# Altium schematic sheet 02_NRF52832.SchDoc: WMI (BLE)
size A4
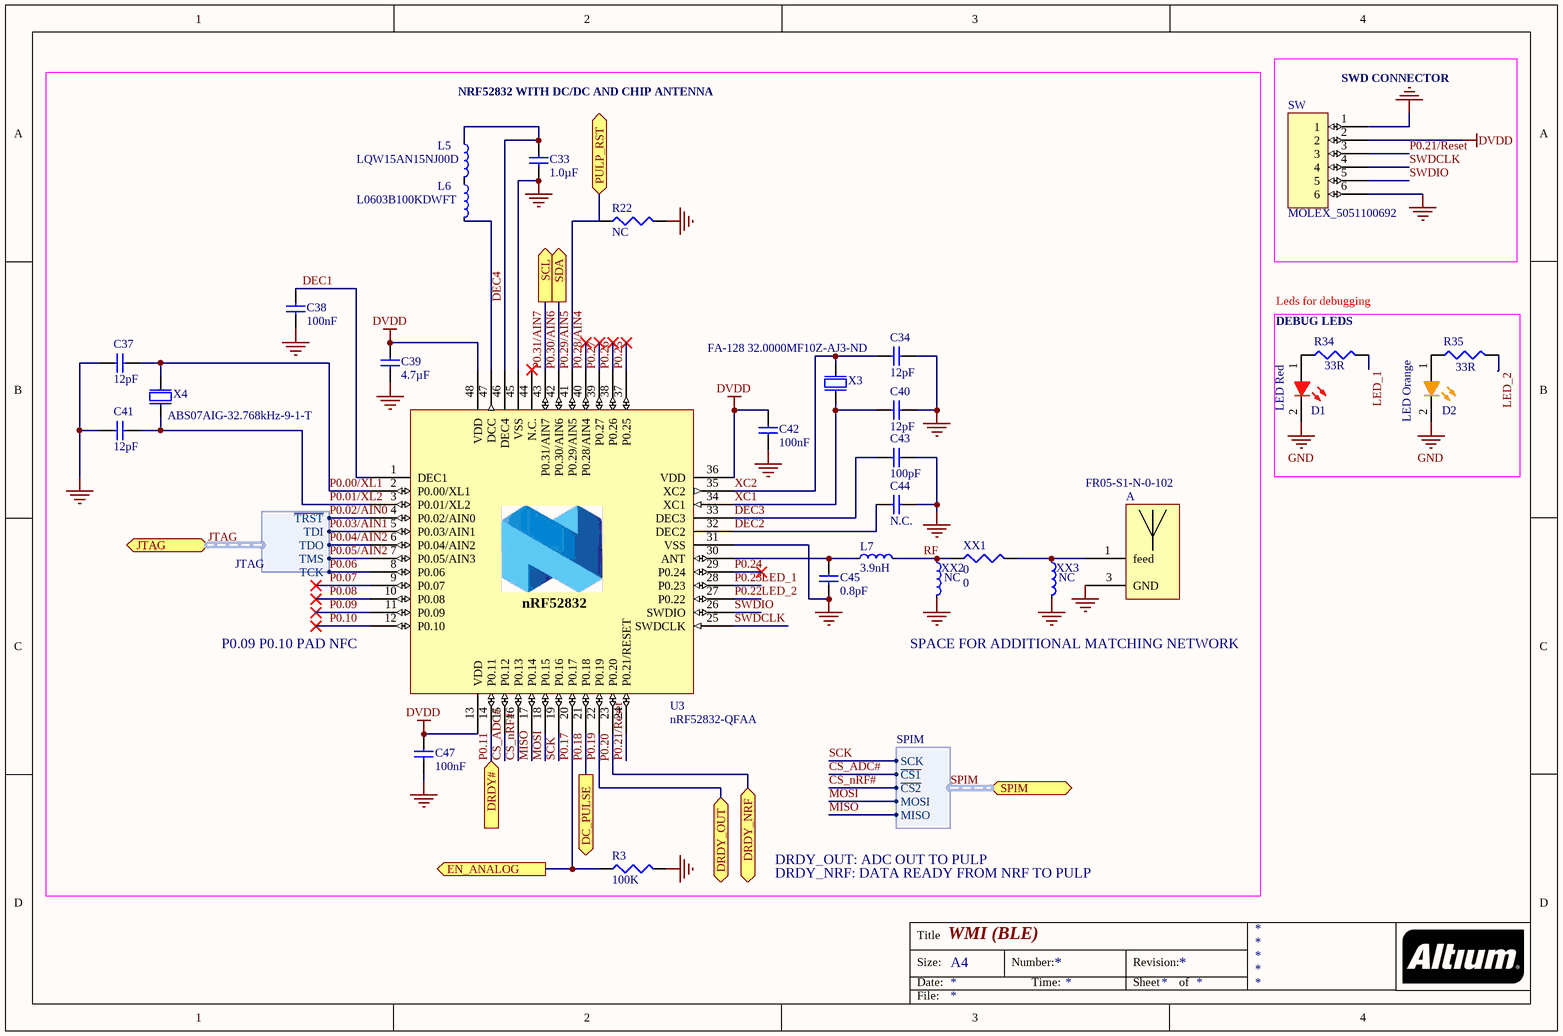
[diagram p0: 02_NRF52832.SchDoc]

## Parts
A  FR05-S1-N-0-102  [DFN510P700X220-2N]
C33  1.0µF  [CAPC1608X06L]
C34  12pF  [CAPC1005X04L]
C37  12pF  [CAPC1005X04L]
C38  100nF  [CAPC1005X04L]
C39  4.7µF  [CAPC1608X06L]
C40  12pF  [CAPC1005X04L]
C41  12pF  [CAPC1005X04L]
C42  100nF  [CAPC1005X04L]
C43  100pF  [CAPC1005X04L]
C44  N.C.  [CAPC1005X04L]
C45  0.8pF  [CAPC1005X04L]
C47  100nF  [CAPC1005X04L]
D1  LED Red  [DIOC1608X08L]
D2  LED Orange  [DIOC1608X08L]
L5  LQW15AN15NJ00D  [INDC1005X04L]
L6  L0603B100KDWFT  [J1-0603]
L7  3.9nH  [INDC1005X04L]
R3  100K  [0402]
R22  NC  [0402]  (graphical)
R34  value 33R  [J1-0603]
R35  value 33R  [J1-0603]
SW  MOLEX_5051100692  [MOLEX_5051100692]
U3  nRF52832-QFAA  [QFN40P600X600X90-48N]
X3  FA-128 32.0000MF10Z-AJ3-ND  [BT-XTAL_2016]
X4  ABS07AIG-32.768kHz-9-1-T  [XTAL_3215]
XX1  0  [0402]
XX2  NC  [INDC1005X04L]
XX3  NC  [INDC1005X04L]

## Blocks framed on the sheet
SWD CONNECTOR: SW
DEBUG LEDS: D1 D2 R34 R35

## Ports
DC_PULSE (out), DRDY# (in), DRDY_NRF (bidir), DRDY_OUT (bidir), EN_ANALOG (out), JTAG (harness JTAG), PULP_RST (bidir), SCL (out), SDA (out), SPIM (harness SPIM)

## Harnesses
SPIM: SCK, ~{CS1}, ~{CS2}, MOSI, MISO
JTAG: ~{TRST}, TCK, TMS, TDI, TDO

## Nets
DVDD: C39.1 C42.1 C47.1 SW.2 U3.13(VDD) U3.36(VDD) U3.48(VDD)
GND: A.3(GND) C33.1 C34.2 C37.2 C38.2 C39.2 C40.2 C41.2 C42.2 C43.2 C44.1 C45.1 C47.2 D1.2(K) D2.2(K) R3.2 R22.2 SW.1 SW.6 U3.31(VSS) U3.45(VSS) U3.49(GND) X3.2(GND) X3.4(GND) XX2.2 XX3.2
CS_ADC#: U3.15(P0.12) ; port SPIM.~{CS1}
CS_nRF#: U3.16(P0.13) ; port SPIM.~{CS2}
DEC1: C38.1 U3.1(DEC1)
DEC2: C44.2 U3.32(DEC2)
DEC3: C43.1 U3.33(DEC3)
DEC4: C33.2 L5.1 U3.46(DEC4)
LED_1: R34.2 U3.28(P0.23)  [also labelled P0.23]
LED_2: R35.2 U3.27(P0.22)  [also labelled P0.22]
MISO: U3.17(P0.14) ; port SPIM.MISO
MOSI: U3.18(P0.15) ; port SPIM.MOSI
P0.00/XL1: C37.1 U3.2(P0.00/XL1) X4.1(inp)
P0.01/XL2: C41.1 U3.3(P0.01/XL2) X4.2(out)
P0.02/AIN0: U3.4(P0.02/AIN0) ; port JTAG.~{TRST}  [project net JTAG.~{TRST}]
P0.03/AIN1: U3.5(P0.03/AIN1) ; port JTAG.TDI  [project net JTAG.TDI]
P0.04/AIN2: U3.6(P0.04/AIN2) ; port JTAG.TDO  [project net JTAG.TDO]
P0.05/AIN2: U3.7(P0.05/AIN3) ; port JTAG.TMS  [project net JTAG.TMS]
P0.06: U3.8(P0.06) ; port JTAG.TCK  [project net JTAG.TCK]
P0.07: U3.9(P0.07)
P0.08: U3.10(P0.08)
P0.09: U3.11(P0.09)
P0.10: U3.12(P0.10)
P0.11: U3.14(P0.11) ; port DRDY#
P0.17: R3.1 U3.20(P0.17) ; port EN_ANALOG
P0.18: U3.21(P0.18) ; port DC_PULSE
P0.19: U3.22(P0.19) ; port DRDY_OUT
P0.20: U3.23(P0.20) ; port DRDY_NRF
P0.21/Reset: SW.3 U3.24(P0.21/RESET)
P0.24: U3.29(P0.24)
P0.25: U3.37(P0.25)
P0.26: U3.38(P0.26)
P0.27: U3.39(P0.27)
P0.28/AIN4: U3.40(P0.28/AIN4)
P0.29/AIN5: R22.1 U3.41(P0.29/AIN5) ; port PULP_RST
P0.30/AIN6: U3.42(P0.30/AIN6) ; port SDA
P0.31/AIN7: U3.43(P0.31/AIN7) ; port SCL
RF: L7.2 XX1.1 XX2.1
SCK: U3.19(P0.16) ; port SPIM.SCK
SWDCLK: SW.4 U3.25(SWDCLK)
SWDIO: SW.5 U3.26(SWDIO)
XC1: C40.1 U3.34(XC1) X3.1(inp)
XC2: C34.1 U3.35(XC2) X3.3(out)
NetA_1: A.1(feed) XX1.2 XX3.1
NetC45_2: C45.2 L7.1 U3.30(ANT)
NetD1_1: D1.1(A) R34.1
NetD2_1: D2.1(A) R35.1
NetL5_2: L5.2 L6.1
NetL6_2: L6.2 U3.47(DCC)

Not connected (* = marked no-connect by the designer): A 2(not_connected); U3 44(N.C.)*

## Buses and harness runs
harness JTAG = port JTAG
harness SPIM = port SPIM

## Notes on the sheet
- NRF52832 WITH DC/DC AND CHIP ANTENNA
- Leds for debugging
- (near U3) P0.09 P0.10 PAD NFC
- SPACE FOR ADDITIONAL MATCHING NETWORK
- DRDY_OUT: ADC OUT TO PULP
- DRDY_NRF: DATA READY FROM NRF TO PULP
- Title
- Size:
- Date:
- A4
- Number:
- Time:
- Revision:
- Sheet
- of
- File:
- (in symbol nRF52832-QFAB) nRF52832

## Library data of the parts
A = FR05-S1-N-0-102: Bluetooth antenna
C33 = C0603-1µ0: Capacitor, X7R, ±10%; Note: 16V; Artikkelnr Noca: 20039335; Artikkelnr Simpro: N.A.; Part Number: C0603-1µ0; Manufacturer: *; Manufacturer Part Number: *; Datasheet: *; LatestRevisionDate: 2013-06-05; Pin Count: 2; Publisher: Nordic Semiconductor; Published: 2009-05-08; Value: 1.0µF; Supplier: *; Supplier part number: *; 2nd source Supplier: *; 2nd source part number: *; Footprint Doc: 0603
C34 C37 C40 C41 = C0402-12p: Capacitor, NP0, ±2%; Note: 50V; Artikkelnr Noca: 20029159; Artikkelnr Simpro: N.A.; Part Number: C0402-12p; Manufacturer: *; Manufacturer Part Number: *; Datasheet: *; LatestRevisionDate: 2011-05-11; Pin Count: 2; Publisher: Nordic Semiconductor; Published: 2009-05-08; Value: 12pF; Supplier: *; Supplier part number: *; 2nd source Supplier: *; 2nd source part number: *; Footprint Doc: 0402
C38 C42 C47 = C0402-100n: Capacitor, X7R, ±10%; Note: 16V; Artikkelnr Noca: 20039200; Artikkelnr Simpro: N.A.; Part Number: C0402-100n; Manufacturer: *; Manufacturer Part Number: *; Datasheet: *; LatestRevisionDate: 2009-11-23; Pin Count: 2; Publisher: Nordic Semiconductor; Published: 2009-05-08; Value: 100nF; Supplier: *; Supplier part number: *; 2nd source Supplier: *; 2nd source part number: *; Footprint Doc: 0402
C39 = C0603-4µ7: Capacitor, X5R, ±10%; Note: 6.3V; Artikkelnr Noca: 20069060; Artikkelnr Simpro: N.A.; Part Number: C0603-4µ7; Manufacturer: *; Manufacturer Part Number: *; Datasheet: *; LatestRevisionDate: 2009-11-23; Pin Count: 2; Publisher: Nordic Semiconductor; Published: 2009-05-08; Value: 4.7µF; Supplier: *; Supplier part number: *; 2nd source Supplier: *; 2nd source part number: *; Footprint Doc: 0603
C43 = C0402-100p: Capacitor, NP0, ±5%; Note: 50V; Artikkelnr Noca: 20029135; Artikkelnr Simpro: N.A.; Part Number: C0402-100p; Manufacturer: *; Manufacturer Part Number: *; Datasheet: *; LatestRevisionDate: 2009-05-08; Pin Count: 2; Publisher: Nordic Semiconductor; Published: 2009-05-08; Value: 100pF; Supplier: *; Supplier part number: *; 2nd source Supplier: *; 2nd source part number: *; Footprint Doc: 0402
C44 = C0402-N.C.: Not mounted; Note: Chip Cap; Artikkelnr Noca: N.A.; Part Number: C0402-N.C.; Manufacturer: *; Manufacturer Part Number: *; Datasheet: *; LatestRevisionDate: 2009-05-08; Pin Count: 2; Publisher: Nordic Semiconductor; Published: 2009-05-08; Value: N.C.; Supplier: *; Supplier part number: *; 2nd source Supplier: *; 2nd source part number: *; Footprint Doc: 0402; Artikkelnr Simpro: N.A.
C45 = C0402-0.8p: Capacitor, NP0, ±5%; Note: 50V; Artikkelnr Noca: 20029147; Artikkelnr Simpro: N.A.; Part Number: C0402-0.8p; Manufacturer: *; Manufacturer Part Number: *; Datasheet: *; LatestRevisionDate: 2012-11-21; Pin Count: 2; Publisher: Nordic Semiconductor; Published: 2009-05-08; Value: 0.8pF; Supplier: *; Supplier part number: *; 2nd source Supplier: *; 2nd source part number: *; Footprint Doc: 0402
D1 = KING-LED-RED-APT1608LSECK/J3-PRV: 1.6X0.8mm SMD CHIP LED LAMP, Hyper Red; Part Number: APT1608LSECK/J4-PRV; Forward Voltage: 1.8V; Test Current: 2mA; ComponentLink1Description: Datasheet; ComponentLink1URL: http://www.kingbrightusa.com/images/catalog/SPEC/APT1608LSECK-J3-PRV.pdf; Supplier 1: Digi-Key; Supplier 2: Mouser; Supplier 3: Digi-Key; Supplier 4: Digi-Key; Supplier Part Number 1: 754-1930-6-ND; Supplier Part Number 2: 604-APT1608LSECKJ3RV; Supplier Part Number 3: 754-1930-1-ND; Supplier Part Number 4: 754-1930-2-ND
D2 = KING-LED-ORANGE-APT1608LSECK/J4-PRV: 1.6X0.8mm SMD CHIP LED LAMP, Super Bright Orange; Forward Voltage: 1.8V; Test Current: 2mA; Part Number: APT1608LSECK/J4-PRV; ComponentLink1Description: Datasheet; ComponentLink1URL: http://www.kingbrightusa.com/images/catalog/SPEC/APT1608LSECK-J4-PRV.pdf; Supplier 1: Digi-Key; Supplier 2: Digi-Key; Supplier 3: Mouser; Supplier 4: Digi-Key; Supplier Part Number 1: 754-1931-6-ND; Supplier Part Number 2: 754-1931-1-ND; Supplier Part Number 3: 604-APT1608LSECKJ4RV; Supplier Part Number 4: 754-1931-2-ND
L5 = L0402-15n: High frequency chip inductor ±10%; Manufacturer: Taiyo Yuden; Manufacturer Part Number: HK100515NJ-T; 2nd source part number: 658-1328; Value: 15nH; Artikkelnr Noca: 33029323; Artikkelnr Simpro: N.A.; Part Number: L0402-15n; LatestRevisionDate: 2012-09-19; Pin Count: 2; Publisher: Nordic Semiconductor; Published: 2010-07-12; Note: High frequency chip inductor ±10%; Supplier: Digi-Key; Datasheet: http://www.yuden.co.jp/productdata/catalog/en/mlci04_e.pdf; Supplier part number: 587-1521-1-ND; 2nd source Supplier: Farnell; Footprint Doc: 0402
L6 = L0603-10µ: Chip inductor, IDC,min = 50 mA, ±20%; Manufacturer: Taiyo Yuden; Manufacturer Part Number: LBMF1608T100K; 2nd source part number: 178-6105; Value: 10µH; Note: LBMF1608T100K 10µH 80mA 0603; Artikkelnr Noca: 33029314; Artikkelnr Simpro: N.A.; Part Number: L0603-10µ; Datasheet: http://www.yuden.co.jp/ut/product/pdf/elb2_e.pdf; LatestRevisionDate: 2012-09-19; Pin Count: 2; Publisher: Nordic Semiconductor; Published: 2010-02-24; Supplier: Digi-Key; Supplier part number: 587-1714-1-ND; 2nd source Supplier: Farnell; Footprint Doc: 0603
L7 = L0402-3n9: High frequency chip inductor ±5%; Manufacturer: Murata; Manufacturer Part Number: LQP15MN3N9B02D; Artikkelnr Noca: 33029151; Artikkelnr Simpro: N.A.; Part Number: L0402-3n9; Datasheet: http://search.murata.co.jp/Ceramy/image/img/PDF/ENG/L0075S0084LQP15M.pdf; LatestRevisionDate: 2012-09-19; Pin Count: 2; Publisher: Nordic Semiconductor; Published: 2009-05-08; Value: 3.9nH; Note: High frequency chip inductor ±5%; Supplier: Digi-Key; Supplier part number: 490-1131-1-ND; 2nd source Supplier: *; 2nd source part number: *; Footprint Doc: 0402
R3 R22 R34 R35 XX1 = Res3: Resistor; Published: 8-Jun-2000; LatestRevisionDate: 29-May-2009; LatestRevisionNote: IPC-7351 Footprint Added.; PackageReference: J1-0603; Publisher: Altium Limited; PackageDescription: Chip Resistor
  R3: Value: 100K
  R22: Value: NC
  XX1: Value: 0
U3 = nRF52832-QFAB: Multi-protocol Bluetooth Low Energy, ANT and 2.4GHz proprietary system-on-chip; Manufacturer: Nordic Semiconductor; Artikkelnr Noca: N.A.; Part Number: nRF52832-QFAA; Manufacturer Part Number: nRF52832-QFAA; Datasheet: *; LatestRevisionDate: 2016-11-24; Pin Count: 48; Publisher: Nordic Semiconductor; Published: 2016-11-24; Value: nRF52832-QFAA; Note: *; Supplier: Nordic Semiconductor; Supplier part number: *; 2nd source Supplier: *; 2nd source part number: *; Footprint Doc: QFN-48; Artikkelnr Simpro: N.A.
X3 = XTAL_SMD2016_32MHz_8pF_General: XTAL SMD 2016, 32MHz, Cl=8pF, Total Tol: ±40ppm; Note: XTAL SMD 32.000MHz; Artikkelnr Noca: N.A.; Part Number: XTAL_SMD2016_32MHz_8pF_General; Manufacturer: *; Manufacturer Part Number: *; Datasheet: *; LatestRevisionDate: 2016-08-19; Pin Count: 4; Publisher: Nordic Semiconductor; Published: 2016-08-19; Value: 32MHz; Supplier: *; Supplier part number: *; 2nd source Supplier: *; 2nd source part number: *; Footprint Doc: XTAL_2016; Artikkelnr Simpro: N.A.
X4 = XTAL_SMD3215_32.768kHz_9pF_General: XTAL SMD 3215, 32.768kHz, Cl=9pF, Total Tol: ±50ppm; Note: XTAL SMD 32.768kHz; Artikkelnr Noca: N.A.; Part Number: XTAL_SMD3215_32.768kHz_9pF_General; Manufacturer: *; Manufacturer Part Number: *; Datasheet: *; LatestRevisionDate: 2016-08-19; Pin Count: 2; Publisher: Nordic Semiconductor; Published: 2016-08-19; Value: 32.768kHz; Supplier: *; Supplier part number: *; 2nd source Supplier: *; 2nd source part number: *; Footprint Doc: XTAL_3215; Artikkelnr Simpro: N.A.
XX2 XX3 = L0402-N.C.: Not mounted; Value: N.C.; Artikkelnr Noca: N.A.; Assembly: Not mounted; Part Number: L0402-N.C.; Manufacturer: *; Manufacturer Part Number: *; Datasheet: *; LatestRevisionDate: 2016-11-24; Pin Count: 2; Publisher: Nordic Semiconductor; Published: 2016-11-24; Note: *; Supplier: *; Supplier part number: *; 2nd source Supplier: *; 2nd source part number: *; Footprint Doc: 0402; Artikkelnr Simpro: N.A.; ComponentLink1Description: Datasheet; ComponentLink2Description: Supplier link